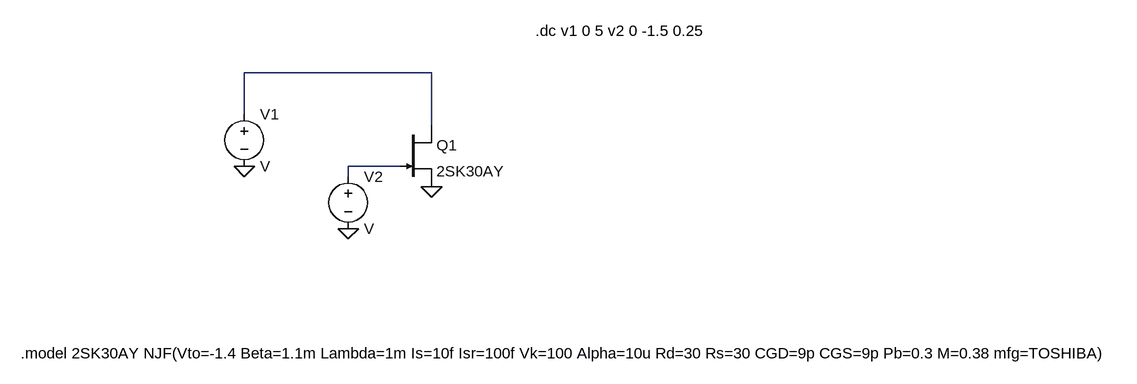
[diagram p0: schematic 2sk30ay.asc]
2sk30ay.asc, the LTspice schematic file:
Version 4
SHEET 1 1352 680
WIRE 304 208 16 208
WIRE 16 272 16 208
WIRE 304 288 304 208
WIRE 256 352 176 352
WIRE 176 368 176 352
FLAG 176 448 0
FLAG 16 352 0
FLAG 304 384 0
SYMBOL njf 256 288 R0
SYMATTR InstName Q1
SYMATTR Value 2SK30AY
SYMBOL Voltage 16 256 R0
SYMATTR InstName V1
SYMBOL Voltage 176 352 R0
SYMATTR InstName V2
TEXT -328 640 Left 2 !.model 2SK30AY NJF(Vto=-1.4 Beta=1.1m Lambda=1m Is=10f Isr=100f Vk=100 Alpha=10u Rd=30 Rs=30 CGD=9p CGS=9p Pb=0.3 M=0.38 mfg=TOSHIBA)
TEXT 464 144 Left 2 !.dc v1 0 5 v2 0 -1.5 0.25

The netlist it stands for:
* 2sk30ay.asc
J§Q1 N001 N002 0 2SK30AY
V1 N001 0 V
V2 N002 0 V
.model NJF NJF
.model PJF PJF
.lib standard.jft
.model 2SK30AY NJF(Vto=-1.4 Beta=1.1m Lambda=1m Is=10f Isr=100f Vk=100 Alpha=10u Rd=30 Rs=30 CGD=9p CGS=9p Pb=0.3 M=0.38 mfg=TOSHIBA)
.dc v1 0 5 v2 0 -1.5 0.25
.backanno
.end